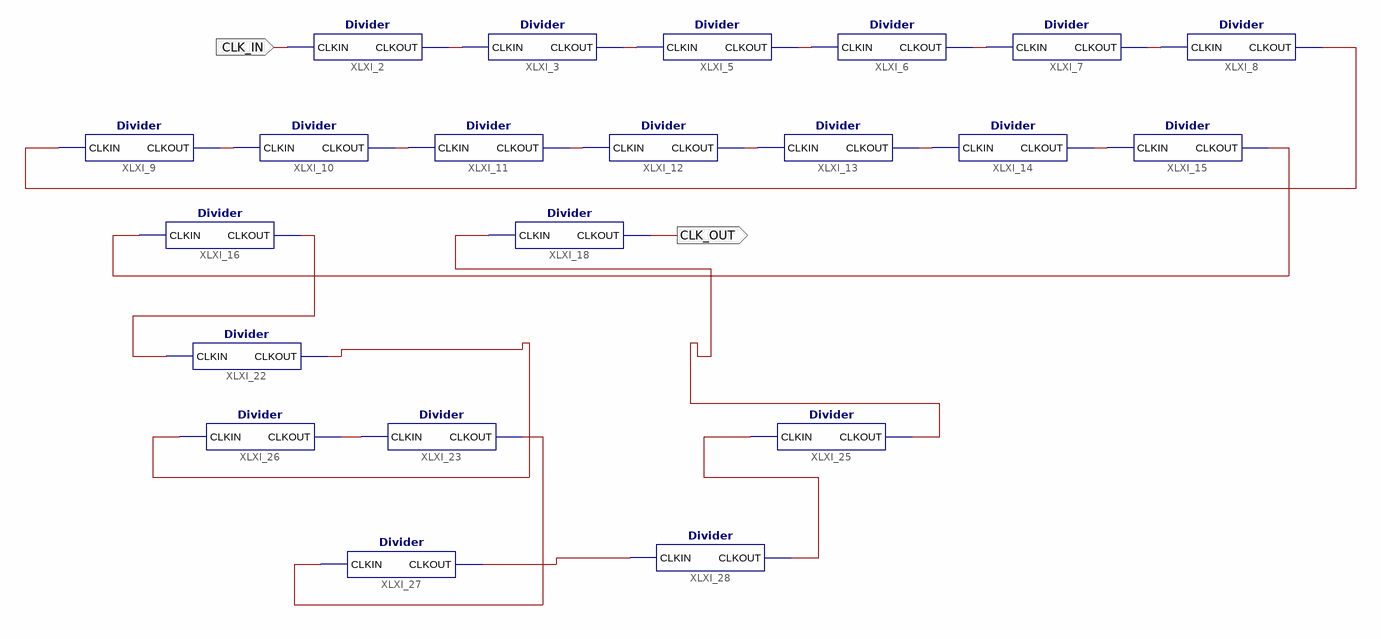
[diagram p0: schematic sheet 1]
// Xilinx ISE schematic Hz60.sch (spartan6) as structural Verilog: 21 symbols, 2 ports
module Hz60 (
  input  CLK_IN,
  output CLK_OUT
);

  wire XLXN_1, XLXN_2, XLXN_3, XLXN_4, XLXN_5, XLXN_6, XLXN_7, XLXN_8, XLXN_9, XLXN_10, XLXN_11, XLXN_15,
       XLXN_16, XLXN_17, XLXN_21, XLXN_22, XLXN_24, XLXN_25, XLXN_26, XLXN_27;

  Divider XLXI_2 (.CLKIN(CLK_IN), .CLKOUT(XLXN_1));
  Divider XLXI_3 (.CLKIN(XLXN_1), .CLKOUT(XLXN_2));
  Divider XLXI_5 (.CLKIN(XLXN_2), .CLKOUT(XLXN_3));
  Divider XLXI_6 (.CLKIN(XLXN_3), .CLKOUT(XLXN_4));
  Divider XLXI_7 (.CLKIN(XLXN_4), .CLKOUT(XLXN_5));
  Divider XLXI_8 (.CLKIN(XLXN_5), .CLKOUT(XLXN_15));
  Divider XLXI_9 (.CLKIN(XLXN_15), .CLKOUT(XLXN_6));
  Divider XLXI_10 (.CLKIN(XLXN_6), .CLKOUT(XLXN_7));
  Divider XLXI_11 (.CLKIN(XLXN_7), .CLKOUT(XLXN_8));
  Divider XLXI_12 (.CLKIN(XLXN_8), .CLKOUT(XLXN_9));
  Divider XLXI_13 (.CLKIN(XLXN_9), .CLKOUT(XLXN_10));
  Divider XLXI_14 (.CLKIN(XLXN_10), .CLKOUT(XLXN_11));
  Divider XLXI_15 (.CLKIN(XLXN_11), .CLKOUT(XLXN_16));
  Divider XLXI_16 (.CLKIN(XLXN_16), .CLKOUT(XLXN_17));
  Divider XLXI_18 (.CLKIN(XLXN_27), .CLKOUT(CLK_OUT));
  Divider XLXI_22 (.CLKIN(XLXN_17), .CLKOUT(XLXN_21));
  Divider XLXI_23 (.CLKIN(XLXN_22), .CLKOUT(XLXN_25));
  Divider XLXI_25 (.CLKIN(XLXN_24), .CLKOUT(XLXN_27));
  Divider XLXI_26 (.CLKIN(XLXN_21), .CLKOUT(XLXN_22));
  Divider XLXI_27 (.CLKIN(XLXN_25), .CLKOUT(XLXN_26));
  Divider XLXI_28 (.CLKIN(XLXN_26), .CLKOUT(XLXN_24));
endmodule
